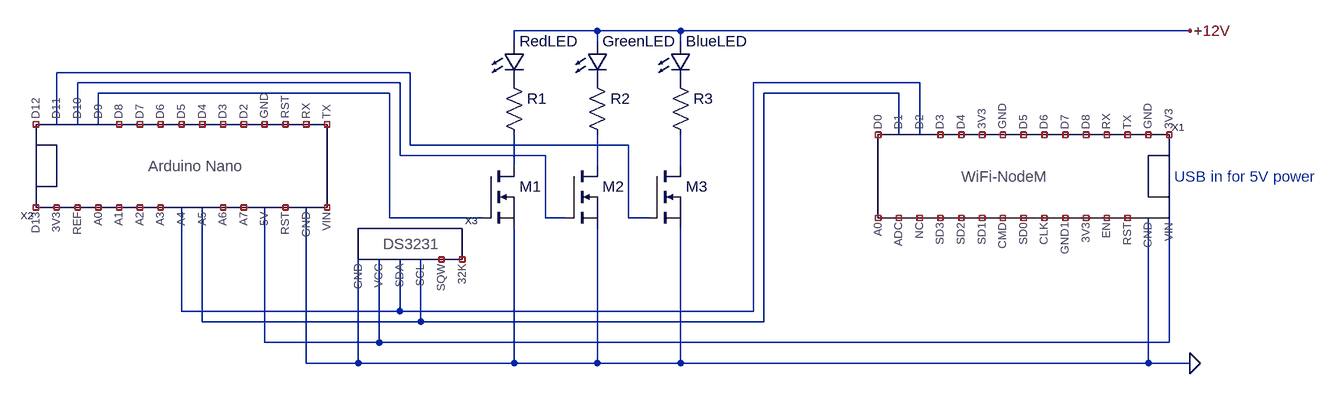
[diagram p0: schematic SunriseClock.asc]
SunriseClock.asc, the LTspice schematic file:
Version 4
SHEET 1 1456 680
WIRE 336 -64 208 -64
WIRE 464 -64 336 -64
WIRE 1248 -64 464 -64
WIRE 208 -48 208 -64
WIRE 336 -48 336 -64
WIRE 464 -48 464 -64
WIRE 48 0 -496 0
WIRE 32 16 -464 16
WIRE 832 16 576 16
WIRE 16 32 -432 32
WIRE 800 32 592 32
WIRE -496 80 -496 0
WIRE -464 80 -464 16
WIRE -432 80 -432 32
WIRE 800 96 800 32
WIRE 832 96 832 16
WIRE 48 112 48 0
WIRE 384 112 48 112
WIRE 32 128 32 16
WIRE 256 128 32 128
WIRE 208 144 208 96
WIRE 336 144 336 96
WIRE 464 144 464 96
WIRE 16 224 16 32
WIRE 160 224 16 224
WIRE 256 224 256 128
WIRE 288 224 256 224
WIRE 384 224 384 112
WIRE 416 224 384 224
WIRE -304 368 -304 208
WIRE 32 368 32 288
WIRE 32 368 -304 368
WIRE 576 368 576 16
WIRE 576 368 32 368
WIRE -272 384 -272 208
WIRE 64 384 64 288
WIRE 64 384 -272 384
WIRE 592 384 592 32
WIRE 592 384 64 384
WIRE -176 416 -176 208
WIRE 0 416 0 288
WIRE 0 416 -176 416
WIRE 1216 416 1216 224
WIRE 1216 416 0 416
WIRE -112 448 -112 208
WIRE -32 448 -32 288
WIRE -32 448 -112 448
WIRE 208 448 208 240
WIRE 208 448 -32 448
WIRE 336 448 336 240
WIRE 336 448 208 448
WIRE 464 448 464 240
WIRE 464 448 336 448
WIRE 1184 448 1184 224
WIRE 1184 448 464 448
WIRE 1248 448 1184 448
FLAG 1248 -64 +12V
FLAG 1248 448 0
SYMBOL LED 192 -48 R0
WINDOW 3 24 64 Invisible 2
SYMATTR InstName RedLED
SYMBOL LED 320 -48 R0
WINDOW 3 24 64 Invisible 2
SYMATTR InstName GreenLED
SYMBOL LED 448 -48 R0
WINDOW 3 24 64 Invisible 2
SYMATTR InstName BlueLED
SYMBOL nmos 160 144 R0
WINDOW 3 56 72 Invisible 2
SYMATTR InstName M1
SYMBOL nmos 288 144 R0
WINDOW 3 56 72 Invisible 2
SYMATTR InstName M2
SYMBOL nmos 416 144 R0
WINDOW 3 56 72 Invisible 2
SYMATTR InstName M3
SYMBOL WiFi-NodeM 768 96 R0
SYMATTR InstName X1
SYMBOL ArduinoNano -256 160 R180
SYMATTR InstName X2
SYMBOL res 192 0 R0
WINDOW 3 36 76 Invisible 2
SYMATTR InstName R1
SYMBOL res 320 0 R0
WINDOW 3 36 76 Invisible 2
SYMATTR InstName R2
SYMBOL res 448 0 R0
WINDOW 3 36 76 Invisible 2
SYMATTR InstName R3
SYMBOL DS3231Module 144 208 R0
SYMATTR InstName X3
TEXT 1224 160 Left 2 ;USB in for 5V power

The netlist it stands for:
* SunriseClock.asc
D§RedLED +12V P001 D
D§GreenLED +12V P002 D
D§BlueLED +12V P003 D
M1 N006 N004 0 0 NMOS
M2 N007 N002 0 0 NMOS
M3 N008 N001 0 0 NMOS
XX1 NC_01 NC_02 NC_03 NC_04 NC_05 NC_06 NC_07 NC_08 NC_09 NC_10 NC_11 NC_12 NC_13 0 N009 NC_14 N005 N003 NC_15 NC_16 NC_17 NC_18 NC_19 NC_20 NC_21 NC_22 NC_23 NC_24 NC_25 NC_26 WiFi-NodeM  ; pins A0 ADC NC SD3 SD2 SD1 CMD SD0 CLK GND1 3V3 EN RST GND VIN D0 D1 D2 D3 D4 3V3 GND D5 D6 D7 D8 RX TX GND 3V3
XX2 NC_27 0 NC_28 N009 NC_29 NC_30 N005 N003 NC_31 NC_32 NC_33 NC_34 NC_35 NC_36 NC_37 NC_38 NC_39 NC_40 NC_41 NC_42 NC_43 NC_44 NC_45 NC_46 NC_47 NC_48 N004 N002 N001 NC_49 ArduinoNano  ; pins VIN GND RST 5V A7 A6 A5 A4 A3 A2 A1 A0 REF 3V3 D13 TX RX RST GND D2 D3 D4 D5 D6 D7 D8 D9 D10 D11 D12
R1 P001 N006 R
R2 P002 N007 R
R3 P003 N008 R
XX3 NC_50 NC_51 N005 N003 N009 0 DS3231Module  ; pins 32K SQW SCL SDA VCC GND
.model D D
.lib standard.dio
.model NMOS NMOS
.model PMOS PMOS
.lib standard.mos
* USB in for 5V power
.backanno
.end